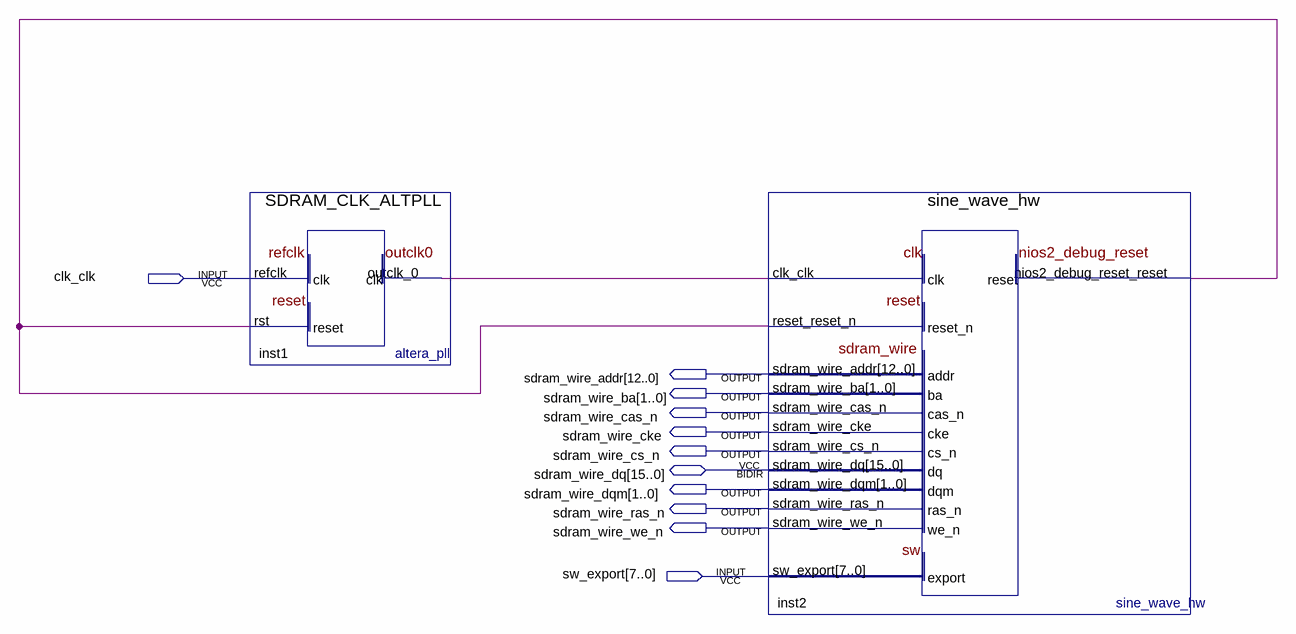
[diagram p0: schematic sheet]
// Quartus schematic sine_wave.bdf as structural Verilog: 2 symbols, 11 pins
module sine_wave (
  input  clk_clk,
  input  [7:0] sw_export,
  inout  [15:0] sdram_wire_dq,
  output [12:0] sdram_wire_addr,
  output [1:0] sdram_wire_ba,
  output sdram_wire_cas_n,
  output sdram_wire_cke,
  output sdram_wire_cs_n,
  output [1:0] sdram_wire_dqm,
  output sdram_wire_ras_n,
  output sdram_wire_we_n
);

  wire inst1_outclk_0, inst2_nios2_debug_reset_reset;

  SDRAM_CLK_ALTPLL inst1 (.refclk(clk_clk), .rst(inst2_nios2_debug_reset_reset), .outclk_0(inst1_outclk_0));
  sine_wave_hw inst2 (
    .clk_clk(inst1_outclk_0), .reset_reset_n(inst2_nios2_debug_reset_reset), .sw_export(sw_export),
    .nios2_debug_reset_reset(inst2_nios2_debug_reset_reset), .sdram_wire_addr(sdram_wire_addr),
    .sdram_wire_ba(sdram_wire_ba), .sdram_wire_cas_n(sdram_wire_cas_n), .sdram_wire_cke(sdram_wire_cke),
    .sdram_wire_cs_n(sdram_wire_cs_n), .sdram_wire_dqm(sdram_wire_dqm), .sdram_wire_ras_n(sdram_wire_ras_n),
    .sdram_wire_we_n(sdram_wire_we_n), .sdram_wire_dq(sdram_wire_dq));
endmodule
